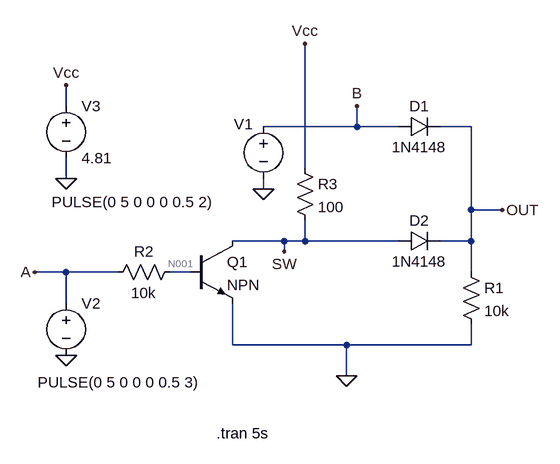
[diagram p0: schematic diode_or.asc]
diode_or.asc, the LTspice schematic file:
Version 4.1
SHEET 1 880 680
WIRE -432 0 -432 -32
WIRE 16 32 16 0
WIRE 16 32 -128 32
WIRE 80 32 16 32
WIRE 192 32 144 32
WIRE -64 96 -64 -96
WIRE -432 112 -432 80
WIRE -128 128 -128 112
WIRE 192 160 192 32
WIRE 240 160 192 160
WIRE -96 208 -176 208
WIRE -64 208 -64 176
WIRE -64 208 -96 208
WIRE 80 208 -64 208
WIRE 192 208 192 160
WIRE 192 208 144 208
WIRE -96 224 -96 208
WIRE -432 256 -480 256
WIRE -352 256 -432 256
WIRE -240 256 -272 256
WIRE 192 256 192 208
WIRE -432 304 -432 256
WIRE -176 368 -176 304
WIRE 0 368 -176 368
WIRE 192 368 192 336
WIRE 192 368 0 368
WIRE 0 416 0 368
FLAG 0 416 0
FLAG 240 160 OUT
FLAG -480 256 A
FLAG 16 0 B
FLAG -432 384 0
FLAG -128 128 0
FLAG -432 112 0
FLAG -432 -32 Vcc
FLAG -64 -96 Vcc
FLAG -96 224 SW
SYMBOL voltage -128 16 R0
WINDOW 123 0 0 Left 0
WINDOW 39 0 0 Left 0
WINDOW 0 -45 12 Left 2
WINDOW 3 -326 132 Left 2
SYMATTR InstName V1
SYMATTR Value PULSE(0 5 0 0 0 0.5 2)
SYMBOL diode 80 48 R270
WINDOW 0 32 32 VTop 2
WINDOW 3 0 32 VBottom 2
SYMATTR InstName D1
SYMATTR Value 1N4148
SYMBOL diode 80 224 R270
WINDOW 0 32 32 VTop 2
WINDOW 3 0 32 VBottom 2
SYMATTR InstName D2
SYMATTR Value 1N4148
SYMBOL res 176 240 R0
SYMATTR InstName R1
SYMATTR Value 10k
SYMBOL voltage -432 288 R0
WINDOW 123 0 0 Left 0
WINDOW 39 0 0 Left 0
WINDOW 3 -44 138 Left 2
SYMATTR InstName V2
SYMATTR Value PULSE(0 5 0 0 0 0.5 3)
SYMBOL npn -240 208 R0
SYMATTR InstName Q1
SYMBOL voltage -432 -16 R0
WINDOW 123 0 0 Left 0
WINDOW 39 0 0 Left 0
SYMATTR InstName V3
SYMATTR Value 4.81
SYMBOL res -256 240 R90
WINDOW 0 0 56 VBottom 2
WINDOW 3 32 56 VTop 2
SYMATTR InstName R2
SYMATTR Value 10k
SYMBOL res -80 80 R0
SYMATTR InstName R3
SYMATTR Value 100
TEXT -200 504 Left 2 !.tran 5s

The netlist it stands for:
* diode_or.asc
V1 B 0 PULSE(0 5 0 0 0 0.5 2)
D1 B OUT 1N4148
D2 SW OUT 1N4148
R1 OUT 0 10k
V2 A 0 PULSE(0 5 0 0 0 0.5 3)
Q1 SW N001 0 0 NPN
V3 Vcc 0 4.81
R2 N001 A 10k
R3 Vcc SW 100
.model D D
.lib standard.dio
.model NPN NPN
.model PNP PNP
.lib standard.bjt
.tran 5s
.backanno
.end

* Results of the author's LTspice run, read from the files saved beside the schematic
* Operating Point, zero values left out:
*   V(out) = 4.222 V
*   V(n001) = 47.68 nV
*   V(sw) = 4.768 V
*   V(vcc) = 4.81 V
*   I(V1) = 2.524 nA
*   Ic(Q1) = 4.768 pA
*   Ib(Q1) = -4.768 pA
*   I(R2) = 4.768 pA
*   I(D2) = 422.2 µA
*   I(V2) = 4.768 pA
*   I(R3) = 422.2 µA
*   I(D1) = -2.524 nA
*   I(R1) = 422.2 µA
*   I(V3) = -422.2 µA
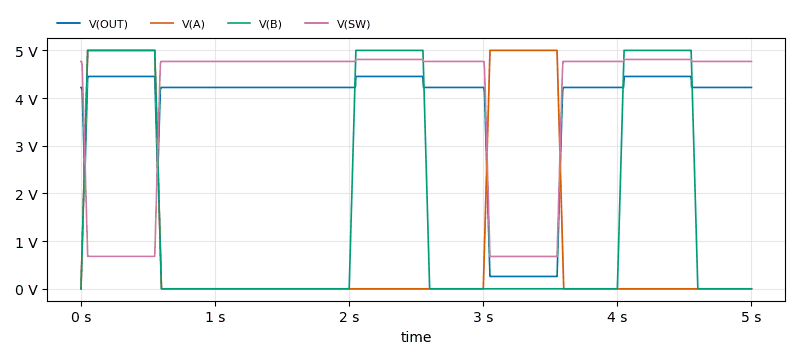
[diagram p1: Transient Analysis of diode_or.asc, plotted from the saved traces]
* Transient Analysis, 1 run:
*   V(OUT): min 259.2 mV, max 4.453 V, average 3.847 V, rms 4.044 V, last 4.222 V
*   V(A): min 0 V, max 5 V, average 1.1 V, rms 2.31 V, last 0 V
*   V(B): min 0 V, max 5 V, average 1.65 V, rms 2.845 V, last 0 V
*   V(SW): min 677.9 mV, max 4.809 V, average 3.89 V, rms 4.23 V, last 4.768 V